# EAGLE design source_eagle (EAGLE 9.6.2)
COMPANY: ADAFRUIT INDUSTRIES; DRAWN: KTOWN; REV: B
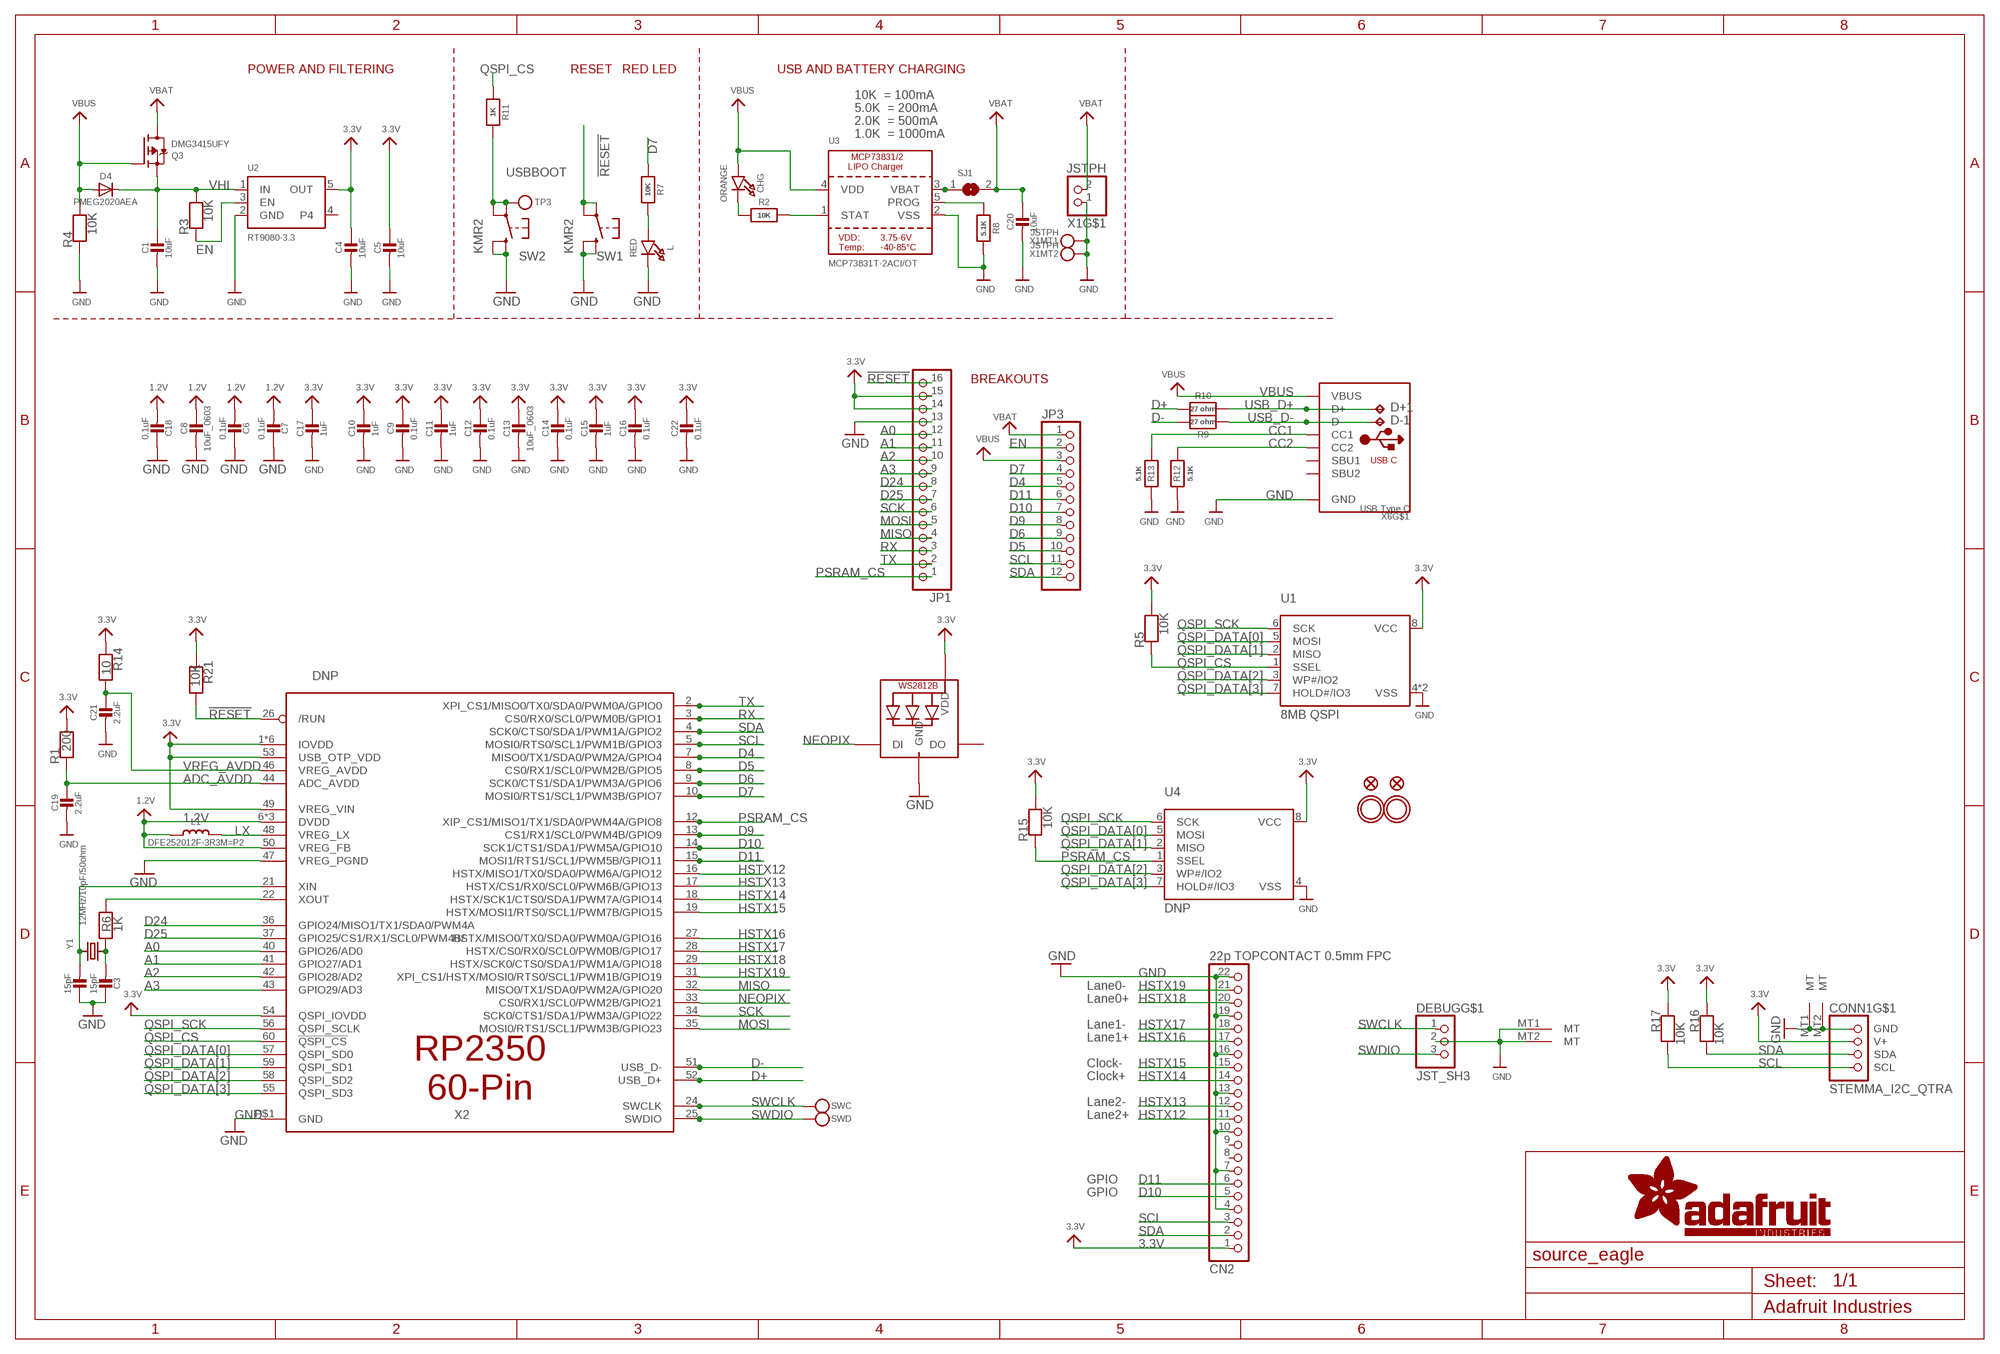
[diagram p0: schematic, sheet 1]

## Parts
C1  10uF  CAP_CERAMIC0805-NOOUTLINE  [0805-NO]
C2  15pF  CAP_CERAMIC_0402NO  [_0402NO]
C3  15pF  CAP_CERAMIC_0402NO  [_0402NO]
C4  10uF  CAP_CERAMIC0805-NOOUTLINE  [0805-NO]
C5  10uF  CAP_CERAMIC0603_NO  [0603-NO]
C6  0.1uF  CAP_CERAMIC_0402NO  [_0402NO]
C7  0.1uF  CAP_CERAMIC_0402NO  [_0402NO]
C8  10uF_0603  CAP_CERAMIC_0603MP  [_0603MP]
C9  0.1uF  CAP_CERAMIC_0402NO  [_0402NO]
C10  1uF  CAP_CERAMIC_0402NO  [_0402NO]
C11  1uF  CAP_CERAMIC_0402NO  [_0402NO]
C12  0.1uF  CAP_CERAMIC_0402NO  [_0402NO]
C13  10uF_0603  CAP_CERAMIC_0603MP  [_0603MP]
C14  0.1uF  CAP_CERAMIC_0402NO  [_0402NO]
C15  1uF  CAP_CERAMIC_0402NO  [_0402NO]
C16  0.1uF  CAP_CERAMIC_0402NO  [_0402NO]
C17  1uF  CAP_CERAMIC_0402NO  [_0402NO]
C18  0.1uF  CAP_CERAMIC_0402NO  [_0402NO]
C19  2.2uF  CAP_CERAMIC_0402NO  [_0402NO]
C20  10uF  CAP_CERAMIC0805-NOOUTLINE  [0805-NO]
C21  2.2uF  CAP_CERAMIC_0402NO  [_0402NO]
C22  0.1uF  CAP_CERAMIC_0402NO  [_0402NO]
CHG  ORANGE  LED0603_NOOUTLINE  [CHIPLED_0603_NOOUTLINE]
CN2  22p TOPCONTACT 0.5mm FPC  HEADER-1X22_22PIN_0.5MM_BOT  [FPC_22PIN]
CONN1  STEMMA_I2C_QTRA  [JST_SH4_RA]
D4  PMEG2020AEA  DIODESOD-323F  [SOD-323F]
D+1  TPB1,27  [B1,27]
D-1  TPB1,27  [B1,27]
DEBUG  JST_SH3  CON_JST_SH_3PINVERT  [JST_SH3_RA]
JP1  HEADER-1X16ROUND  [1X16_ROUND]
JP3  HEADER-1X12  [1X12_ROUND]
L  RED  LED0603_NOOUTLINE  [CHIPLED_0603_NOOUTLINE]
L1  DFE252012F-3R3M=P2  INDUCTOR  [INDUCTOR_1007]
LED1  WS2812B_SK6805_1515  [SK6805_1515]
Q3  DMG3415UFY  MOSFET-P_DFN2015  [DFN2015-3]
R1  200  RESISTOR_0402NO  [_0402NO]
R2  10K  RESISTOR_0402NO  [_0402NO]
R3  10K  RESISTOR_0402NO  [_0402NO]
R4  10K  RESISTOR_0402NO  [_0402NO]
R5  10K  RESISTOR_0402NO  [_0402NO]
R6  1K  RESISTOR_0402NO  [_0402NO]
R7  10K  RESISTOR_0402NO  [_0402NO]
R8  5.1K  RESISTOR_0402NO  [_0402NO]
R9  27 ohm  RESISTOR_0402NO  [_0402NO]
R10  27 ohm  RESISTOR_0402NO  [_0402NO]
R11  1K  RESISTOR_0402NO  [_0402NO]
R12  5.1K  RESISTOR_0402NO  [_0402NO]
R13  5.1K  RESISTOR_0402NO  [_0402NO]
R14  10  RESISTOR_0402NO  [_0402NO]
R15  10K  RESISTOR_0402NO  [_0402NO]
R16  10K  RESISTOR_0402NO  [_0402NO]
R17  10K  RESISTOR_0402NO  [_0402NO]
R21  10K  RESISTOR_0402NO  [_0402NO]
SJ1  SOLDERJUMPERCLOSED  [SOLDERJUMPER_CLOSEDWIRE]
SW1  KMR2  SWITCH_TACT_SMT_RKB2  [BTN_RKB2_4.6X2.8]
SW2  KMR2  SWITCH_TACT_SMT_RKB2  [BTN_RKB2_4.6X2.8]
SWC  TESTPOINTROUND1MM  [TESTPOINT_ROUND_1MM]
SWD  TESTPOINTROUND1MM  [TESTPOINT_ROUND_1MM]
TP3  TESTPOINTROUND1.5MMNO  [TESTPOINT_ROUND_1.5MM_NO]
U1  8MB QSPI  SPIFLASH_8PIN_4X4  [USON8_4X4]
U2  RT9080-3.3  VREG_SOT23-5  [SOT23-5]
U3  MCP73831T-2ACI/OT  MCP73831/2  [SOT23-5]
U4  DNP  SPIFLASH_8PIN  [SOIC8_150MIL]
U$31  MOUNTINGHOLE2.5  [MOUNTINGHOLE_2.5_PLATED]
U$32  MOUNTINGHOLE2.5  [MOUNTINGHOLE_2.5_PLATED]
U$34  FIDUCIAL_1MM  [FIDUCIAL_1MM]
U$35  FIDUCIAL_1MM  [FIDUCIAL_1MM]
X1  JSTPH  CON_JST_PH_2PIN_MT_BATT  [JSTPH2_BATT]
X2  DNP  RP2350_QFN60  [QFN60_7MM_REDUCEDEPAD]
X6  USB Type C  USB_C  [USB_C_CUSB31-CFM2AX-01-X]
Y1  12MHz/10pF/50ohm  CRYSTAL2.5X2.0  [CRYSTAL_2.5X2]

## Nets
1.2V: C6.2 C7.2 C8.1 C18.2 L1.P$1 X2.6(DVDD) X2.23(DVDD) X2.39(DVDD) X2.50(VREG_FB)
3.3V: C4.1 C5.1 C9.1 C10.1 C11.1 C12.1 C13.1 C14.1 C15.1 C16.1 C17.1 C22.1 CN2.1 CONN1.2(V+) JP1.14 JP1.15 LED1.2(VDD) R1.2 R5.2 R14.1 R15.2 R16.1 R17.1 R21.1 U1.8(VCC) U2.5(OUT) U4.8(VCC) X2.1(IOVDD) X2.11(IOVDD) X2.20(IOVDD) X2.30(IOVDD) X2.38(IOVDD) X2.45(IOVDD) X2.49(VREG_VIN) X2.53(USB_OTP_VDD) X2.54(QSPI_IOVDD)
!RESET: JP1.16 R21.2 SW1.A'(P1) SW1.A(P) X2.26(/RUN)
A0: JP1.12 X2.40(GPIO26/AD0)
A1: JP1.11 X2.41(GPIO27/AD1)
A2: JP1.10 X2.42(GPIO28/AD2)
A3: JP1.9 X2.43(GPIO29/AD3)
ADC_AVDD: C19.1 R1.1 X2.44(ADC_AVDD)
CC1: R13.2 X6.A5(CC1)
CC2: R12.2 X6.B5(CC2)
D4: JP3.5 X2.7(MISO0/TX1/SDA0/PWM2A/GPIO4)
D5: JP3.10 X2.8(CS0/RX1/SCL0/PWM2B/GPIO5)
D6: JP3.9 X2.9(SCK0/CTS1/SDA1/PWM3A/GPIO6)
D7: JP3.4 R7.1 X2.10(MOSI0/RTS1/SCL1/PWM3B/GPIO7)
D9: JP3.8 X2.13(CS1/RX1/SCL0/PWM4B/GPIO9)
D10: CN2.5 JP3.7 X2.14(SCK1/CTS1/SDA1/PWM5A/GPIO10)
D11: CN2.6 JP3.6 X2.15(MOSI1/RTS1/SCL1/PWM5B/GPIO11)
D24: JP1.8 X2.36(GPIO24/MISO1/TX1/SDA0/PWM4A)
D25: JP1.7 X2.37(GPIO25/CS1/RX1/SCL0/PWM4B/)
D+: R10.2 X2.52(USB_D+)
D-: R9.2 X2.51(USB_D-)
EN: JP3.2 R3.1 U2.3(EN)
GND [power]: C1.2 C2.1 C3.1 C4.2 C5.2 C6.1 C7.1 C8.2 C9.2 C10.2 C11.2 C12.2 C13.2 C14.2 C15.2 C16.2 C17.2 C18.1 C19.2 C20.2 C21.2 C22.2 CN2.4 CN2.7 CN2.10 CN2.13 CN2.16 CN2.19 CN2.22 CONN1.1(GND) CONN1.MT1(MT) CONN1.MT2(MT) DEBUG.2 DEBUG.MT1(MT) DEBUG.MT2(MT) JP1.13 L.C LED1.4(GND) R4.1 R8.2 R12.1 R13.1 SW1.B'(S1) SW1.B(S) SW2.B'(S1) SW2.B(S) U1.4(VSS) U1.PAD(VSS) U2.2(GND) U3.2(VSS) U4.4(VSS) X1.1 X1.NC1 X1.NC2 X2.47(VREG_PGND) X2.P$1(GND) X6.A1B12(GND) X6.B1A12(GND)
HSTX12: CN2.11 X2.16(HSTX/MISO1/TX0/SDA0/PWM6A/GPIO12)
HSTX13: CN2.12 X2.17(HSTX/CS1/RX0/SCL0/PWM6B/GPIO13)
HSTX14: CN2.14 X2.18(HSTX/SCK1/CTS0/SDA1/PWM7A/GPIO14)
HSTX15: CN2.15 X2.19(HSTX/MOSI1/RTS0/SCL1/PWM7B/GPIO15)
HSTX16: CN2.17 X2.27(HSTX/MISO0/TX0/SDA0/PWM0A/GPIO16)
HSTX17: CN2.18 X2.28(HSTX/CS0/RX0/SCL0/PWM0B/GPIO17)
HSTX18: CN2.20 X2.29(HSTX/SCK0/CTS0/SDA1/PWM1A/GPIO18)
HSTX19: CN2.21 X2.31(XPI_CS1/HSTX/MOSI0/RTS0/SCL1/PWM1B/GPIO19)
LX: L1.P$2 X2.48(VREG_LX)
MISO: JP1.4 X2.32(MISO0/TX1/SDA0/PWM2A/GPIO20)
MOSI: JP1.5 X2.35(MOSI0/RTS1/SCL1/PWM3B/GPIO23)
N$1: CHG.C R2.1
N$2: L.A R7.2
N$3: R2.2 U3.1(STAT)
N$4: R8.1 U3.5(PROG)
N$5: C2.2 X2.21(XIN) Y1.3
N$6: C3.2 R6.1 Y1.1
N$7: R6.2 X2.22(XOUT)
N$8 [power]: SJ1.1 U3.3(VBAT)
NEOPIX: LED1.1(DI) X2.33(CS0/RX1/SCL0/PWM2B/GPIO21)
PSRAM_CS: JP1.1 R15.1 U4.1(SSEL) X2.12(XIP_CS1/MISO1/TX1/SDA0/PWM4A/GPIO8)
QSPI_CS: R5.1 R11.1 U1.1(SSEL) X2.60(!QSPI_CS)
QSPI_DATA[0]: U1.5(MOSI) U4.5(MOSI) X2.57(QSPI_SD0)
QSPI_DATA[1]: U1.2(MISO) U4.2(MISO) X2.59(QSPI_SD1)
QSPI_DATA[2]: U1.3(WP#/IO2) U4.3(WP#/IO2) X2.58(QSPI_SD2)
QSPI_DATA[3]: U1.7(HOLD#/IO3) U4.7(HOLD#/IO3) X2.55(QSPI_SD3)
QSPI_SCK: U1.6(SCK) U4.6(SCK) X2.56(QSPI_SCLK)
RX: JP1.3 X2.3(CS0/RX0/SCL0/PWM0B/GPIO1)
SCK: JP1.6 X2.34(SCK0/CTS1/SDA1/PWM3A/GPIO22)
SCL: CN2.3 CONN1.4(SCL) JP3.11 R17.2 X2.5(MOSI0/RTS0/SCL1/PWM1B/GPIO3)
SDA: CN2.2 CONN1.3(SDA) JP3.12 R16.2 X2.4(SCK0/CTS0/SDA1/PWM1A/GPIO2)
SWCLK: DEBUG.1 SWC.P$1 X2.24(SWCLK)
SWDIO: DEBUG.3 SWD.P$1 X2.25(SWDIO)
TX: JP1.2 X2.2(XPI_CS1/MISO0/TX0/SDA0/PWM0A/GPIO0)
USB_D+: D+1.TP R10.1 X6.A6(D+) X6.B6(D+)
USB_D-: D-1.TP R9.1 X6.A7(D-) X6.B7(D-)
USBBOOT: R11.2 SW2.A'(P1) SW2.A(P) TP3.P$1
VBAT [power]: C20.1 JP3.1 Q3.3(D) SJ1.2 X1.2
VBUS [power]: CHG.A D4.A JP3.3 Q3.1(G) R4.2 U3.4(VDD) X6.A4B9(VBUS) X6.B4A9(VBUS)
VHI: C1.1 D4.C Q3.2(S) R3.2 U2.1(IN)
VREG_AVDD: C21.1 R14.2 X2.46(VREG_AVDD)
Unconnected: CN2.8 CN2.9 LED1.3(DO) U2.4 X6.A8(SBU1) X6.B8(SBU2) X6.M1(MT) X6.M2(MT) X6.M3(MT) X6.M4(MT)

## Notes on the sheet
- POWER AND FILTERING | RESET | RED LED | USB AND BATTERY CHARGING
- 10K  = 100mA
- 5.0K  = 200mA
- 2.0K  = 500mA
- 1.0K  = 1000mA
- BREAKOUTS
- Lane0-
- Lane0+
- Lane1-
- Lane1+
- Clock-
- Clock+
- Lane2-
- Lane2+
- GPIO
- GPIO

## Library data of the parts
C1-C3 C5-C22 = microbuilder:CAP_CERAMIC: Ceramic Capacitors For new designs, use the packages preceded by an '_' character since they are more reliable: The following footprints should be used on most boards: _0402 - Standard footprint for regular board layouts _0603 - Standard footprint for regular board layouts _0805 - Standard footprint for regular board layouts _1206 - Standard footprint for regular board layouts For extremely tight-pitch boards where space is at a premium, the following 'micro-pitch' footprints can be used (smaller pads, no silkscreen outline, etc.): _0402MP - Micro-pitch footprint for very dense/compact boards _0603MP - Micro-pitch footprint for very dense/compact boards _0805MP - Micro-pitch footprint for very dense/compact boards _1206MP - Micro-pitch footprint for very dense/compact boards
C4 = microbuilder:CAP_CERAMIC: Ceramic Capacitors For new designs, use the packages preceded by an '_' character since they are more reliable: The following footprints should be used on most boards: _0402 - Standard footprint for regular board layouts _0603 - Standard footprint for regular board layouts _0805 - Standard footprint for regular board layouts _1206 - Standard footprint for regular board layouts For extremely tight-pitch boards where space is at a premium, the following 'micro-pitch' footprints can be used (smaller pads, no silkscreen outline, etc.): _0402MP - Micro-pitch footprint for very dense/compact boards _0603MP - Micro-pitch footprint for very dense/compact boards _0805MP - Micro-pitch footprint for very dense/compact boards _1206MP - Micro-pitch footprint for very dense/compact boards; REV: B
CHG L = microbuilder:LED: LED 0603 - 0603 Surface Mount Package 2mA: Green LED - Low Power (3.9mcd, 2ma, 1.7Vf) - Digikey: 475-2709-2-ND Orange LED - Low Power (9.8mcd, 2ma, 1.8Vf) - Digikey: 475-1194-2-ND Red LED - Low Power (5mcd, 2ma, 1.8Vf) - Digikey: 475-1195-2-ND Yellow LED - Low Power (7mcd, 2ma, 1.8Vf) - Digikey: 475-1196-2-ND 5mA: Blue LED - Low Power (17mcd, 5ma, 2.9Vf) - Digikey: LNJ937W8CRACT-ND 0805 - 0805 Surface Mount Package 2mA: Red LED (8.8mcd, 2mA, 1.8Vf, Clear) - Low Power [Digikey: 475-2510-1-ND] Green LED (5mcd, 2mA, 1.8Vf, Clear) - Low Power [Digikey: 475-2730-1-ND] Yellow LED (11.3mcd, 2mA, 1.8Vf, Clear) - Low Power [Digikey: 475-2555-1-ND] 20mA: Red LED (104mcd, 20mA, Diffused) - LS R976 [Digikey: 475-1278-6-ND] Red LED (12mcd, 20mA, 2.0Vf, Clear) - APT2012EC [Digikey: 754-1128-1-ND] Green LED (15mcd, 20mA, 2.2Vf, Clear) - APT2012GC [Digikey: 754-1131-1-ND] Orange LED (160mcd, 20mA, 2.1Vf, Clear) - APT2012SECK [Digikey: 754-1130-1-ND] 1206 - 1206 Surface Mount Package Green LED (26mcd, 20mA, Diffused) - LG N971 [Digikey: 475-1407-6-ND] Red LED (15mcd, 20mA, Diffused) - LH N974 [Digikey: 475-1416-6-ND] Cree - Cree High-Power Surface Mount LEDs XPEBWT-L1-0000-00D50 - White 111lm 350mA 2.9Vf 6200K 110° XTEAWT-00-0000-00000LEE3 - White 114lm 350mA 2.85Vf 5000K 115° Everlight - Everlight 45-21 Series Surface Mount LEDs 45-21/QK2C-B2832AC2CB2/2T - Warm White 2000mcd 20mA 3.25Vf 3050K 120° 45-21/LK2C-B38452C4CB2/2T - Nuetral White 2000mcd 20mA 3.25Vf 4150K 120° 45-21/LK2C-B50634C6CB2/2T - Cold White 2200mcd 20mA 3.25Vf 5650K 120° PLCC2 Reverse Mount LS T77K-J1L2-1-0-2-R18-Z - Red 11.25mcd 2mA 1.8Vf 630nm 120° LO T77K-L1M2-24-Z - Orange 19.6mcd 2mA 1.8Vf 606nm 120° LY T77K-K2M1-26-Z - Yellow 15.7mcd 2mA 1.8Vf 587nm 120°; ROT: 270
CN2 = adafruit_electromech:HEADER-1X22
CONN1 = adafruit_electromech:STEMMA_I2C; LCSC: C145961
D4 = adafruit:DIODE: Diode SMADIODE - SMA Surface Mount Package 20V 1A Schottky Diode Digikey: 641-1014-6-ND DO-1N4148 - Through Hole Small Current Diode SOD-123 20V 1 A (.5mV Vf) Schottky Diode - Digikey: MBRX120TPMSCT-ND SOD-323 10V 570mA (.38mV Vf, 3ns) Schottky Diode - Digikey: ZLLS410CT-ND SOD-523 30V 30mA Schottky Diode (RB751S-40TE61) - Digikey: RB751S-40TE61CT-ND SOT23-R/W - SOT23 Package (R = Solder Paste/Reflow Ovens, W = Hand-Soldering) BAT54Film 40V 300mA - Digikey: 497-7162-1-ND
D+1 D-1 = testpad:TP: Test pad
DEBUG = adafruit_electromech:CON_JST_SH_3PIN
JP1 = microbuilder:HEADER-1X16: PIN HEADER
JP3 = microbuilder:HEADER-1X12
L1 = microbuilder:INDUCTOR: Inductors 0603: 10nH Ceramic Inductor - microwire antenna/RF (Digikey: 712-1434-2-ND) 0805: 560nH Ceramic Inductor - RF (Digikey: 553-1047-1-ND) 270nH Ceramic Inductor - Q = 40@250MHz, +-5%, 1 Ohm DC Resistance (Digikey: 535-10506-2-ND) 1007 (2518 Metric) SMT: 10µH 10% 250mOhm 820mA 1007 Inductor (Digikey: 587-2189-1-ND) 22µH 10% 500mOhm 580mA 1007 Inductor (Digikey: 587-2190-1-ND) 47µH 10% 950mOhm 420mA 1007 Inductor (Digikey: 587-2191-1-ND) 47µH 5% 100mOhm 1A 1008 Inductor (Digikey: 732-1816-1-ND) 5.0x5.0mm (Taiyo Yuden NR5040 Series) 6.8µH 20% 2.3A 64mOhm Inductor (Digikey: 587-2374-2-ND) 5.0x5.0mm (TDK VLC5045 Series) 4.7µH 20% 3.3A 34mOhm Inductor (Digikey: 445-6526-1-ND) 6.8µH 20% 2.7A 46mOhm Inductor (Digikey: 445-6527-1-ND) 6.0x6.0mm (TDK VLC6045 Series) 4.7µH 20% 3.8A 27mOhm Inductor (Digikey: 445-6538-2-ND) 6.8µH 20% 3A 41mOhm Inductor (Digikey: 445-6540-1-ND) 6.2µH 30% 2.2A 45mOhm Inductor (Digikey: SRR5028-6R2YCT-ND) - Not TDK VLC6045 but footprint should match 6.0x6.0mm (TDK SLF6045 Series) 6.8uH 30% 2A 33mOhm Inductor (Digikey: 445-4572-1-ND, Mouser: 810-SLF645T6R8N2R0PF) 6.0x6.0mm (Sumida CDRH5D28 Series) 6.2uH 30% 1.8A 45mOhm Inductor (Digikey: 308-1542-1-ND) Taiyo Yuden NR3015T2R2M - 2.2uH 20% 1.5A (Digikey: 587-1648-2-ND, Mouser: 963-NR3015T2R2M) - Used with TI TPS62172 CoilCraft RFID Transponder Coil - MA5532-AE (For use with AS3935 Lightning Sensor) Taiyo Yuden NRH2412T2R2MNGH - 2.2uH 20% 1AA (Digikey: 587-3443-1-ND) - Used with TI LM3671 Vishay IHLP 1.0uH Molded Inductor - 24mOhm DCR, 5A, +/-20%, -55°C-125°C (Digikey: 541-1319-1-ND)
LED1 = microbuilder:WS2812B; LCSC: C2890035
Q3 = microbuilder:MOSFET-P: P-Channel Mosfet LEGEND VDS: Voltage Drain-Source ID: Drain Current RDS(ON): Drain-Source On-State Resistance VGS(TH): Gate-Source Threshold Voltage CISS: Drain-Source Input Capacitance SOT-23 Name VDS ID RDS(ON) VGS(TH) CISS Order Number IRLML5103 30V 760mA 600 mOhm -- 75pF @ 25V Digikey: IRLML5103PBFCT-ND IRLML6401 12V 4.3A 50 mOhm 950mV @ 250µA 830pF @ 10V Digikey: IRLML6401PBFTR-ND NTR0202PL 20V 400mA 800 mOhm 2.3V @ 250uA 70pF @ 5V Digikey: NTR0202PLT1GOSTR-ND NTR4101PT1G 20V 1.8A 85 mOhm 1.2V @ 250uA 675pF @ 10V Digikey: NTR4101PT1GOSCT-ND DMP2004K 20V 600mA 900 mOhm 1V @ 250uA 175pF @ 16V Digikey: DMP2004KDICT-ND PMV65XP 20V 3.9A 76 mOhm 950mV @ 1mA 725pF @ 20V Digikey: 568-2358-2-ND TO-252 Name VDS ID RDS(ON) VGS(TH) CISS Order Number AOD417 30V 25A 34 mOhm 3V @ 250µA 920pF @ 15V Digikey: 785-1106-2-ND PowerPak Name VDS ID RDS(ON) VGS(TH) CISS Order Number AON7401 30V 12A 14 mOhm 3V @ 250µA 2600pF @ 15V Digikey: 785-1302-1-ND
R1-R17 R21 = microbuilder:RESISTOR: Resistors For new designs, use the packages preceded by an '_' character since they are more reliable: The following footprints should be used on most boards: _0402 - Standard footprint for regular board layouts _0603 - Standard footprint for regular board layouts _0805 - Standard footprint for regular board layouts _1206 - Standard footprint for regular board layouts For extremely tight-pitch boards where space is at a premium, the following 'micro-pitch' footprints can be used (smaller pads, no silkscreen outline, etc.): _0402MP - Micro-pitch footprint for very dense/compact boards _0603MP - Micro-pitch footprint for very dense/compact boards _0805MP - Micro-pitch footprint for very dense/compact boards _1206MP - Micro-pitch footprint for very dense/compact boards
SJ1 = microbuilder:SOLDERJUMPER: SMD Solder JUMPER Solder the two pads together to create a connection, or remove the solder to break it. REFLOW - Use this footprint for solder paste and reflow ovens. WAVE - Use this footprint for hand-soldering (larger pads). CLOSED - Has a trace between the two pads to ensure it is closed by default. The trace needs to be cut to disable the jumper, and can be closed again by creating a solder bridge between the two pads.
SW1 SW2 = adafruit_electromech:SWITCH_TACT_SMT: SMT Tact Switches RKB2 https://www.digikey.com/short/m027prz5
SWC SWD TP3 = microbuilder:TESTPOINT: Test Point Various test points for characterisation and PCB testing TESTPOINT_SMT - Compact Surface Mount Test Point [Digikey: 5016KTR-ND]
U1 U4 = microbuilder:SPIFLASH_8PIN: SOIC8 SPI Flash Be careful with the size since SOIC8 flash comes in several 'widths' SOIC8 150 mil M25P16 - 16Mbit (2Mbit x 8) Serial Flash (75MHz SPI Bus), Supply: 2.7-3.6V Digikey: SOIC8 - M25P16-VMN6P-ND SOIC8 208 mil W25Q16BVSSIG - 16Mbit (2Mbit x 8) Serial Flash (104MHz SPI Bus), Supply: 2.7-3.6V Digikey: SOIC8 - W25Q16BVSSIG-ND
U2 = adafruit_power:VREG_SOT23-5: SOT23-5 Fixed Voltage Regulators Part Current Out V Out V In V Dropout θJA (°C/W) TJ (°C) Digikey Part No. ADP121 150mA 3.3V 3.4-5.5V 0.09V @ 150mA -- -- ADP121-AUJZ33R7CT-ND ADP121 150mA 3.0V 3.1-5.5V 0.09V @ 150mA -- -- ADP121-AUJZ30R7CT-ND ADP122 300mA 3.3V 3.4-5.5V 0.085V @ 300mA -- -- ADP122AUJZ-3.3-R7CT-ND ADP1712 300mA 3.3V 3.5-5.5V 0.17V @ 300mA -- -- ADP1712AUJZ-3.3-R7TR-ND AP7311 (Low Cost) 150mA 3.3V 3.5-6V 0.15V @ 150mA -- -- AP7311-33WG-7DICT-ND LD39015M18R 150mA 1.8V 1.9V-5.5V 0.08V @ 100mA -- -- 497-6977-1-ND LP2985A-33DBVR 150mA 3.3V 3.3-16V 0.28V @ 150mA 206 150 296-18479-1-ND MCP1824T-3302E/OT 300mA 3.3V 3.5V-6V 0.2V @ 300mA -- -- MCP1824T-3302E/OTCT-ND MIC5205-2.5YM5 TR 150mA 2.5V 2.7-16V 0.165V @ 150mA -- -- 576-1257-2-ND MIC5205-3.0YM5 TR 150mA 3.0V 3.2V-16V 0.165V @ 150mA -- -- 576-1258-2-ND MIC5205-3.3YM5 TR 150mA 3.3V 3.5V-16V 0.165V @ 150mA -- -- 576-1259-2-ND TPS780330220 150mA 3.3V+2.2V 3.6-5.5V 250mV Max -- -- 296-23332-1-ND TDA3663/N1,135 100mA 3.3V 3.5-45V 0.18V @ 50mA -- -- 568-5343-1-ND Max operating temp can be calculated using θJA, TJ (max junction temperature), and power in watts. Set the "Maximum Ambient Temperature" until it reaches TJ ("Max Junction Temperature"), which is the absolute limit for safe use of the regulator: Heat Sink Temperature Calculator <http://www.daycounter.com/Calculators/Heat-Sink-Temperature-Calculator.phtml> For example, With 12V source into a 3.3V LP2985 and a 30mA load, we are dissipating (12V-3.3V) * 0.03A = 0.261W. With a θJA of 206 °C/W, a TJ of 150°C, and 261mW we can safely use the chip without a heat sink up to 75°C (=147.1°C Junction Temperature).; JLC_ROTATION: 0
U3 = microbuilder:MCP73831/2: MCP73831/2 LIPO Charger VDD: 3.75 - 6V Temp -40 - 85°C Programmable Charge Rate: 15-500mA NOTE: STAT is a tri-state logic output on the MCP73831 and an open-drain output on the MCP73832. SOT23-5 with 4.2V output and tri-state logic on STAT = MCP73831T-2ACI/OT; JLC_ROTATION: 0; LCSC: C424093
U$31 U$32 = adafruit_electromech:MOUNTINGHOLE: Mounting Hole For #2 screws (0.086"/2.18mm width, 0.094"/2.4mm hole) use 2.5mm; BOM: EXCLUDE
U$34 U$35 = microbuilder:FIDUCIAL: Fiducial Alignment Points Various fiducial points for machine vision alignment.; BOM: EXCLUDE
X1 = adafruit_electromech:CON_JST_PH_2PIN_MT; LCSC: C47647
X2 = adafruit_micro:RP2350
X6 = adafruit_electromech:USB_C: USB Type-C USB 2.0 Connector; LCSC: C165948
Y1 = microbuilder:CRYSTAL: Crystals HC49UP - Surface Mount Crystal 4.0MHz 18pF +/-30ppm Surface Mount Crystal [Digikey: 535-9857-1-ND] 12.0 MHz Surface Mount Crystal [Digikey: 535-9869-6-ND] 25.0 MHz Surface Mount Crystal [Digikey: 535-9078-1-ND] 2.5 x 2.0mm - MEMs SMT Crystal 16.0 MHz 10pF 20ppm 2.5 x 2.0mm Crystal [Digikey -40-85°C: 535-10923-1-ND] 3.2 x 2.5mm - MEMs SMT Crystal 12.0 MHz 8pF 15ppm 3.2 x 2.5mm Crystal [Digikey: -10-70°C: 644-1047-1-ND -40-125°C: 644-1128-1-ND] 40~85°C cheaper: 644-1173-6-ND 16.0 MHz 8pF 15ppm 3.2 x 2.5mm Crystal [Digikey: -10-70°C: 644-1049-1-ND -40-125°C: 644-1129-2-ND]-40~85°C cheaper: 644-1175-6-ND 16.0 MHz 10pF 10ppm 3.2 x 2.5mm Crystal [Digikey: 644-1100-1-ND] 27.12 MHz 18pF 30ppm 3.2 x 2.5mm Crystal [Digikey: 887-1424-1-ND] 27.12MHz 10pF 10ppm 3.2 x 2.5mm Crystal [Digikey: 887-1329-1-ND] 4.9 x 1.8mm - MEMs SMT Crystal 32.768 KHz 12.5pF 20ppm 4.9 x 1.8mm Crystal [Digikey: SE2415CT-ND] 8.0 x 3.8mm - Surface Mount Crystal 32.768kHz 12.5pF 20ppm -40°C-85°C [Digikey: 535-9166-2-ND] Cylinder 32.768KHz Cylinder Crystal (2x6mm body) [Ex. Digikey: 300-8341-2-ND]

## Net classes
1 power: width 0.305 mm, drill 0.381 mm
2 gnd: width 0.254 mm

## Board
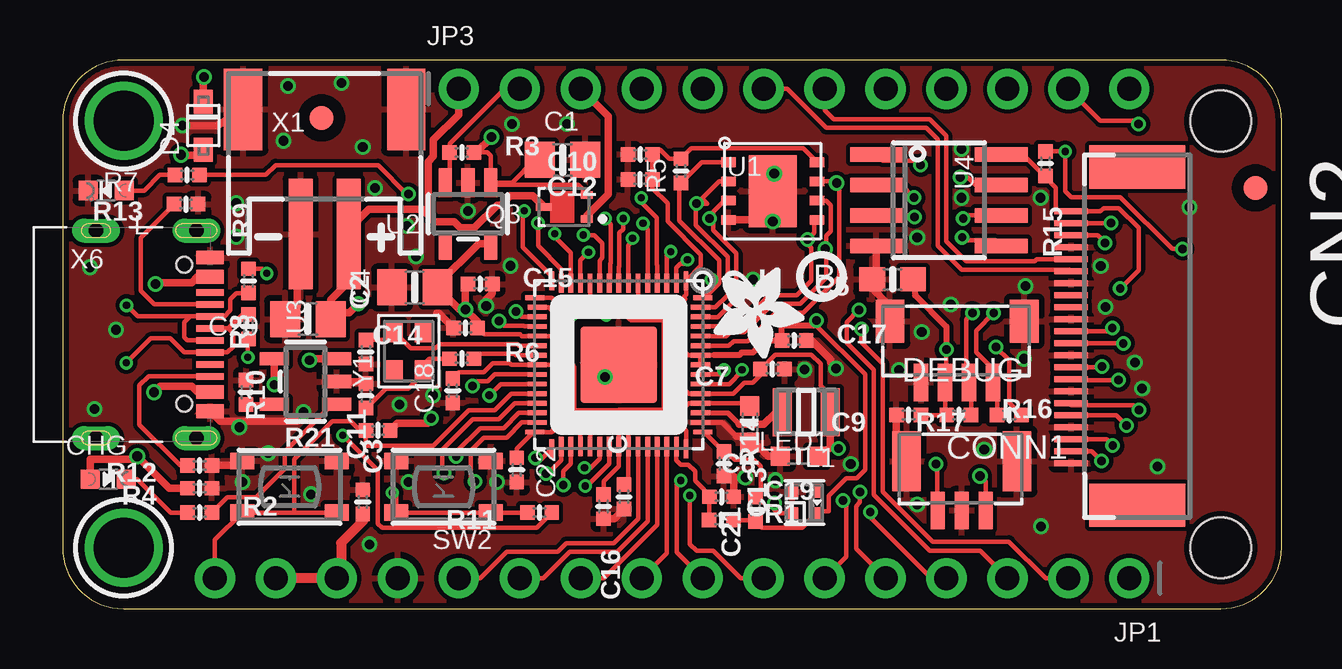
[diagram p1: board, top side]
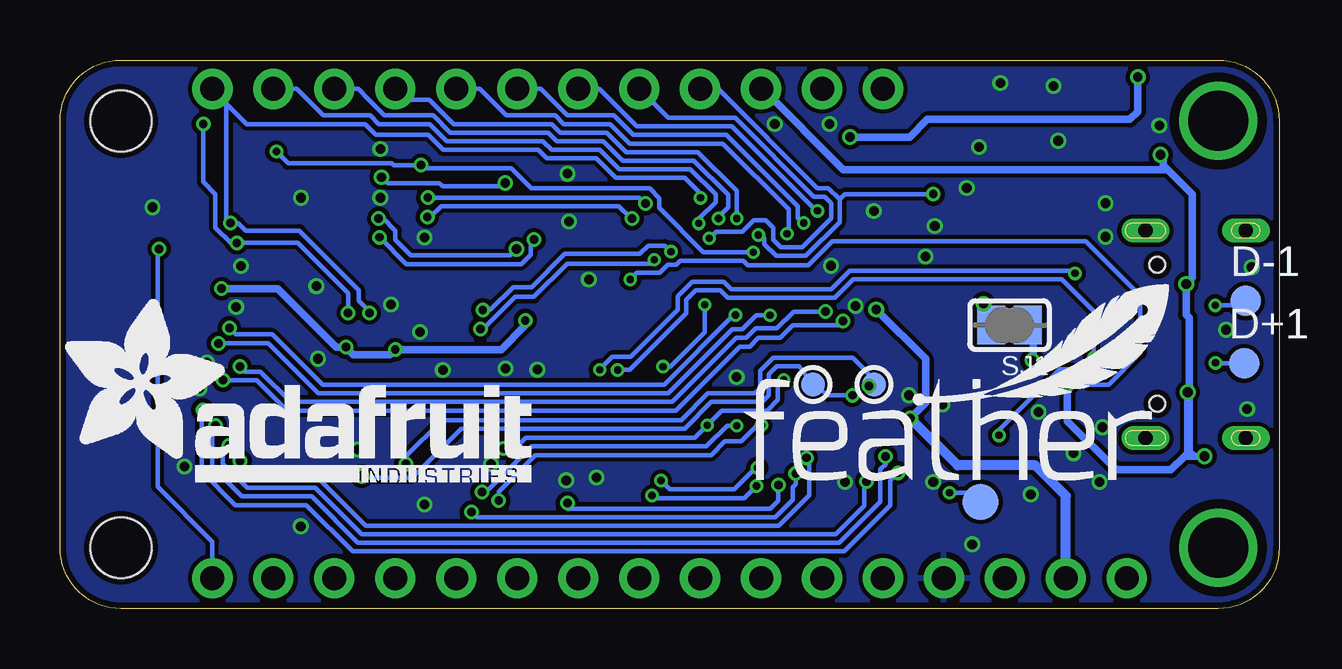
[diagram p2: board, bottom side, seen from below]

Size 50.8 x 22.86 mm. Coordinates in mm from the lower left corner, seen from the top.
Outline: 2.54,0 48.26,0 arc90 50.8,2.54 50.8,20.32 arc90 48.26,22.86 2.54,22.86 arc90 0,20.32 0,2.54 arc90 2.54,0
Copper layers (1*16): Top 0.035mm / dielectric 1.5mm / Bottom 0.035mm
Design rules "adafruit 7-7 *": minimum track width 7mil, minimum drill 8mil, track to track 7mil, track to pad 7mil, pad to pad 7mil, via to via 7mil, smd to smd 7mil, copper to edge 10mil, drill to drill 8mil, minimum pad ring 7mil, minimum via ring 5mil, stop-mask expansion 2mil, vias tented up to drill 20mil, thermal gap 10mil
Holes 2.54 mm at 48.26,20.32 48.26,2.54

### Footprints (pad centres in the part's own frame; a part is rotated, then mirrored left to right if it is on the bottom)
0805-NO = smd 1.24 x 1.5: 1 -0.95,0; 2 0.95,0
_0402NO = smd 0.6 x 0.6: 1 -0.508,0; 2 0.508,0
0603-NO = smd 1.075 x 1: 1 -0.85,0; 2 0.85,0
_0603MP = smd 0.8 x 0.8: 1 -0.762,0; 2 0.762,0
CHIPLED_0603_NOOUTLINE = smd 0.8 x 0.8: A 0,-0.75; C 0,0.75
FPC_22PIN = smd 0.25 x 1.4: 1 -5.25,-1.154; 2 -4.75,-1.154; 3 -4.25,-1.154; 4 -3.75,-1.154; 5 -3.25,-1.154; 6 -2.75,-1.154; 7 -2.25,-1.154; 8 -1.75,-1.154; 9 -1.25,-1.154; 10 -0.75,-1.154; 11 -0.25,-1.154; 12 0.25,-1.154; 13 0.75,-1.154; 14 1.25,-1.154; 15 1.75,-1.154; 16 2.25,-1.154; 17 2.75,-1.154; 18 3.25,-1.154; 19 3.75,-1.154; 20 4.25,-1.154; 21 4.75,-1.154; 22 5.25,-1.154 | smd 1.8 x 4: SUPPORT1 7,1.598; SUPPORT2 -7.1,1.598
JST_SH4_RA = smd 0.6 x 1.55: 1 1.5,0.924; 2 0.5,0.924; 3 -0.5,0.924; 4 -1.5,0.924 | smd 1.2 x 1.8: MT1 -2.8,-1.624; MT2 2.8,-1.624
SOD-323F = smd 1 x 0.8: A -1,0; C 1,0
B1,27 = smd 1.27 x 1.27: TP 0,0
JST_SH3_RA = smd 0.6 x 1.55: 1 1,0.924; 2 0,0.924; 3 -1,0.924 | smd 1.2 x 2.5: MT1 -2.3,-1.124; MT2 2.3,-1.124
1X16_ROUND = drill 1 pad 1.676: 1 -19.05,0; 2 -16.51,0; 3 -13.97,0; 4 -11.43,0; 5 -8.89,0; 6 -6.35,0; 7 -3.81,0; 8 -1.27,0; 9 1.27,0; 10 3.81,0; 11 6.35,0; 12 8.89,0; 13 11.43,0; 14 13.97,0; 15 16.51,0; 16 19.05,0
1X12_ROUND = drill 1 pad 1.676: 1 -13.97,0; 2 -11.43,0; 3 -8.89,0; 4 -6.35,0; 5 -3.81,0; 6 -1.27,0; 7 1.27,0; 8 3.81,0; 9 6.35,0; 10 8.89,0; 11 11.43,0; 12 13.97,0
INDUCTOR_1007 = smd 0.8 x 2: P$1 -1,0; P$2 1,0
SK6805_1515 = smd 0.5 x 0.5: 1 -0.5,-0.45; 2 0.5,-0.45; 3 0.5,0.45; 4 -0.5,0.45
DFN2015-3 = smd 0.5 x 0.31: 1 -0.95,0.5; 2 -0.95,-0.5 | smd 0.65 x 0.31: 3 0.825,0
SOLDERJUMPER_CLOSEDWIRE = smd 1.168 x 1.6: 1 -0.762,0; 2 0.762,0 | smd 0.635 x 0.203: WIRE 0,0
BTN_RKB2_4.6X2.8 = smd 1 x 0.7: A 1.973,1.075; A' -1.973,1.075; B 1.973,-1.075; B' -1.973,-1.075
TESTPOINT_ROUND_1MM = smd 1 x 1: P$1 0,0
TESTPOINT_ROUND_1.5MM_NO = smd 1.5 x 1.5: P$1 0,0
USON8_4X4 = smd 0.6 x 0.4: 1 -1.85,1.2; 2 -1.85,0.4; 3 -1.85,-0.4; 4 -1.85,-1.2; 5 1.85,-1.2; 6 1.85,-0.4; 7 1.85,0.4; 8 1.85,1.2 | smd 2 x 3: PAD 0,0
SOT23-5 = smd 0.55 x 1.2: 1 -0.95,-1.3; 2 0,-1.3; 3 0.95,-1.3; 4 0.95,1.3; 5 -0.95,1.3
SOIC8_150MIL = smd 0.6 x 2.2: 1 -1.905,-2.6; 2 -0.635,-2.6; 3 0.635,-2.6; 4 1.905,-2.6; 5 1.905,2.6; 6 0.635,2.6; 7 -0.635,2.6; 8 -1.905,2.6
MOUNTINGHOLE_2.5_PLATED = drill 2.5 pad 3.2: P$1 0,0
FIDUCIAL_1MM = smd 1 x 1: 1 0,0
JSTPH2_BATT = smd 1 x 4.6: 1 -1,-2.303; 2 1,-2.303 | smd 1.6 x 3.4: NC1 -3.4,2.897; NC2 3.4,2.897
QFN60_7MM_REDUCEDEPAD = smd 0.8 x 0.2: 1 -3.5,2.8; 2 -3.4,2.4; 3 -3.4,2; 4 -3.4,1.6; 5 -3.4,1.2; 6 -3.4,0.8; 7 -3.4,0.4; 8 -3.4,0; 9 -3.4,-0.4; 10 -3.4,-0.8; 11 -3.4,-1.2; 12 -3.4,-1.6; 13 -3.4,-2; 14 -3.4,-2.4; 15 -3.5,-2.8; 31 3.5,-2.8; 32 3.4,-2.4; 33 3.4,-2; 34 3.4,-1.6; 35 3.4,-1.2; 36 3.4,-0.8; 37 3.4,-0.4; 38 3.4,0; 39 3.4,0.4; 40 3.4,0.8; 41 3.4,1.2; 42 3.4,1.6; 43 3.4,2; 44 3.4,2.4; 45 3.5,2.8 | smd 0.2 x 0.8: 16 -2.8,-3.5; 17 -2.4,-3.4; 18 -2,-3.4; 19 -1.6,-3.4; 20 -1.2,-3.4; 21 -0.8,-3.4; 22 -0.4,-3.4; 23 0,-3.4; 24 0.4,-3.4; 25 0.8,-3.4; 26 1.2,-3.4; 27 1.6,-3.4; 28 2,-3.4; 29 2.4,-3.4; 30 2.8,-3.5; 46 2.8,3.5; 47 2.4,3.4; 48 2,3.4; 49 1.6,3.4; 50 1.2,3.4; 51 0.8,3.4; 52 0.4,3.4; 53 0,3.4; 54 -0.4,3.4; 55 -0.8,3.4; 56 -1.2,3.4; 57 -1.6,3.4; 58 -2,3.4; 59 -2.4,3.4; 60 -2.8,3.5 | smd 3.2 x 3.2: P$1 0,0
USB_C_CUSB31-CFM2AX-01-X = smd 0.575 x 1.15: A1B12 -3.2,2.275; A4B9 -2.4,2.275; B1A12 3.2,2.275; B4A9 2.4,2.275 | smd 0.275 x 1.15: A5 -1.25,2.275; A6 -0.25,2.275; A7 0.25,2.275; A8 1.25,2.275; B5 1.75,2.275; B6 0.75,2.275; B7 -0.75,2.275; B8 -1.75,2.275 | drill 0.6 pad 1 long: M1 -4.32,1.7; M2 4.32,1.7; M3 -4.32,-2.48; M4 4.32,-2.48 | hole 0.65: 2.89,1.2; -2.89,1.2
CRYSTAL_2.5X2 = smd 0.9 x 0.75: 1 -0.825,-0.625; 2 0.825,-0.625; 3 0.825,0.625; 4 -0.825,0.625

### Placement (x,y rotation side)
C1  20.83,18.7 0 top
C2  12.64,10.69 90 top
C3  12.64,8.86 270 top
C4  14.67,13.38 180 top
C5  34.58,13.73 180 top
C6  23.39,4.66 90 top
C7  29.58,9.98 180 top
C8  30.67,6.35 180 top
C9  35.26,8.06 180 top
C10  24.07,18.93 180 top
C11  12.51,4.45 90 top
C12  24.07,17.88 180 top
C13  28.64,7.68 270 top
C14  16.79,11.7 180 top
C15  17.4,13.53 0 top
C16  22.54,4.25 270 top
C17  30.48,11.18 0 top
C18  16.26,9.08 90 top
C19  27.46,4.66 0 top
C20  10.22,12.06 180 top
C21  27.56,6.03 270 top
C22  18.92,5.78 270 top
CHG  1.91,5.4 270 top
CN2  43.18,11.3 270 top
CONN1  37.27,10.35 180 top
D4  5.87,20.13 90 top
D+1  1.46,10.22 0 bottom
D-1  1.4,12.83 0 bottom
DEBUG  37.47,5.02 180 top
JP1  25.4,1.27 180 top
JP3  30.48,21.65 0 top
L  1.82,17.42 90 top
L1  30.99,8.19 180 top
LED1  30.91,4.42 0 top
PLABEL0  [PLABEL0]  16.07,7.37 0 top
PLABEL1  [PLABEL1]  9.78,7.37 0 top
PLABEL2  [PLABEL2]  3.61,5.64 90 top
PLABEL3  [PLABEL3]  3.61,17.45 90 top
PLABEL4  [PLABEL4]  6.35,2.79 0 top
PLABEL5  [PLABEL5]  13.78,2.73 0 top
PLABEL6  [PLABEL6]  16.51,2.73 0 top
PLABEL7  [PLABEL7]  19.05,2.73 0 top
PLABEL8  [PLABEL8]  21.59,2.79 0 top
PLABEL9  [PLABEL9]  24.13,2.79 0 top
PLABEL10  [PLABEL10]  26.67,2.79 0 top
PLABEL11  [PLABEL11]  29.21,2.79 0 top
PLABEL12  [PLABEL12]  31.75,2.79 0 top
PLABEL13  [PLABEL13]  34.29,2.79 0 top
PLABEL14  [PLABEL14]  36.83,2.79 0 top
PLABEL15  [PLABEL15]  39.37,2.79 0 top
PLABEL16  [PLABEL16]  41.91,2.79 0 top
PLABEL17  [PLABEL17]  42.1,20.13 0 top
PLABEL18  [PLABEL18]  44.96,20.13 0 top
PLABEL19  [PLABEL19]  39.37,20.13 0 top
PLABEL20  [PLABEL20]  36.83,20.13 0 top
PLABEL21  [PLABEL21]  34.29,20.13 0 top
PLABEL22  [PLABEL22]  31.94,20.13 0 top
PLABEL23  [PLABEL23]  29.34,20.13 0 top
PLABEL24  [PLABEL24]  26.67,20.13 0 top
PLABEL25  [PLABEL25]  24.26,20.13 0 top
PLABEL26  [PLABEL26]  21.59,20.13 0 top
PLABEL27  [PLABEL27]  18.99,20.13 0 top
PLABEL28  [PLABEL28]  16.51,20.13 0 top
PLABEL29  [PLABEL29]  10.29,2.79 0 top
PLABEL30  [PLABEL30]  48.01,11.24 90 top
PLABEL31  [PLABEL31]  33.24,10.93 90 top
PLABEL32  [PLABEL32]  33.5,6.01 90 top
PLABEL33  [PLABEL33]  38.62,13.75 0 top
PLABEL34  [PLABEL34]  23.95,14.71 0 top
PLABEL35  [PLABEL35]  32.03,11.25 90 top
PLABEL36  [PLABEL36]  44.51,2.79 0 top
PLABEL37  [PLABEL37]  28.77,14.48 0 bottom
PLABEL38  [PLABEL38]  44.45,2.35 90 bottom
PLABEL39  [PLABEL39]  41.91,2.35 90 bottom
PLABEL40  [PLABEL40]  39.37,2.35 90 bottom
PLABEL41  [PLABEL41]  36.83,2.35 90 bottom
PLABEL42  [PLABEL42]  34.29,2.35 90 bottom
PLABEL43  [PLABEL43]  33.21,2.86 0 bottom
PLABEL44  [PLABEL44]  29.21,2.35 90 bottom
PLABEL45  [PLABEL45]  26.67,2.35 90 bottom
PLABEL46  [PLABEL46]  24.13,2.35 90 bottom
PLABEL47  [PLABEL47]  19.05,2.35 90 bottom
PLABEL48  [PLABEL48]  21.59,2.35 90 bottom
PLABEL49  [PLABEL49]  16.51,2.35 90 bottom
PLABEL50  [PLABEL50]  15.37,2.73 0 bottom
PLABEL51  [PLABEL51]  11.11,2.35 90 bottom
PLABEL52  [PLABEL52]  9.14,2.35 90 bottom
PLABEL53  [PLABEL53]  6.35,2.35 90 bottom
PLABEL54  [PLABEL54]  44.45,17.84 90 bottom
PLABEL55  [PLABEL55]  41.91,17.84 90 bottom
PLABEL56  [PLABEL56]  39.37,19.62 90 bottom
PLABEL57  [PLABEL57]  36.83,19.62 90 bottom
PLABEL58  [PLABEL58]  34.29,19.62 90 bottom
PLABEL59  [PLABEL59]  32.7,20.07 0 bottom
PLABEL60  [PLABEL60]  29.91,20.07 0 bottom
PLABEL61  [PLABEL61]  27.11,20.07 0 bottom
PLABEL62  [PLABEL62]  24.57,20.07 0 bottom
PLABEL63  [PLABEL63]  23.05,20.07 0 bottom
PLABEL64  [PLABEL64]  19.05,18.61 90 bottom
PLABEL65  [PLABEL65]  16.51,18.1 90 bottom
PLABEL67  [PLABEL67]  12.89,13.65 0 bottom
PLABEL68  [PLABEL68]  15.49,19.43 0 bottom
Q3  20.89,16.74 180 top
R1  27.44,3.7 0 top
R2  5.71,4 0 top
R3  16.64,19.01 0 top
R4  5.71,5.02 180 top
R5  25.77,18.24 90 top
R6  16.64,10.41 0 top
R7  5.19,18.07 180 top
R8  7.65,9.02 90 top
R9  7.75,13.65 90 top
R10  7.75,11.75 270 top
R11  19.88,4 180 top
R12  5.71,5.97 180 top
R13  5.14,16.85 180 top
R14  28.88,4.14 90 top
R15  40.96,18.54 270 top
R16  37.35,8.06 0 top
R17  39.45,8.06 180 top
R21  13.14,7.43 180 top
SJ1  11.24,11.81 180 bottom
SW1  9.46,5.08 180 top
SW2  15.88,5.08 180 top
SWC  16.89,9.33 270 bottom
SWD  19.43,9.33 270 bottom
TP3  12.45,4.45 0 bottom
U1  29.59,17.4 0 top
U2  16.89,16.45 180 top
U3  10.12,9.46 90 top
U4  36.51,17.02 270 top
U$31  2.54,20.32 270 top
U$32  2.54,2.54 270 top
U$34  10.79,20.45 270 top
U$35  49.7,17.53 270 top
U$73  [ADAFRUIT_3.5MM]  27.11,14.22 270 top
U$74  [PCBFEAT-REV-040]  31.62,13.84 0 top
U$75  [FEATHERLOGO_MED]  22.42,5.27 0 bottom
U$76  [ADAFRUIT_TEXT_20MM]  50.74,5.27 0 bottom
X1  10.92,17.91 0 top
X2  23.18,10.16 270 top
X6  3.87,11.43 270 top
Y1  14.41,10.73 90 top

### Tracks (layer width: path | path; a pad name or v marks a point on that pad's centre or on a via)
1.2V  (via drill 0.3, 0.35)
  Top 0.178: C18.2 16.51,9.84 17.55,9.84 17.93,10.22 18.63,10.22 18.7,10.16 X2.23 20.41,10.16 20.64,9.92 v20.64,9.53 | C6.2 23.58,5.35 X2.39 23.58,7.24 23.83,7.49 | v32.32,6.68 32.26,6.68 31.99,6.95 L1.P$1 31.99,8.89 31.59,9.29 31.59,10.2 31.2,10.58 29.7,10.58 29.11,9.98 C7.2 29.07,9.73 28.75,9.41 28.4,9.41 27.95,8.96 X2.50 26.09,8.96 25.68,9.38 v25.68,10.08 | X2.6 23.98,12.7 v23.94,12.66
  Top 0.203: v23.83,7.64 23.83,7.49
  Top 0.305: L1.P$1 31.99,6.7 C8.1
  Bottom 0.178: v32.32,6.68 31.82,6.68 31.38,7.11 24.36,7.11 v23.83,7.64 23.22,8.26 21.34,8.26 20.89,8.7 20.89,9.28 v20.64,9.53 | v25.68,10.08 25.38,10.08 23.94,11.52 v23.94,12.66
3.3V  (via drill 0.35, 0.38, 0.39)
  Top 0.178: U2.5 17.78,15.21 | 21.27,8.26 21.32,8.21 21.23,8.21 | 25.08,8.24 25.08,8.26 | 25.15,12.13 25.15,12.06 25.08,12.06 | 22.14,12.82 21.98,12.99 X2.11 | C14.1 17.57,11.42 19.08,11.42 19.14,11.36 X2.20 20.45,11.36 | C15.1 16.79,13.53 | 23.18,8.26 X2.38 23.18,5.93 22.54,5.3 C16.1 | 20.44,7.42 20.38,7.36 X2.30 19.62,7.36 18.92,6.67 C22.1 | 25.91,12.9 25.91,13.03 25.98,13.09 X2.1 26.6,14.28 26.6,14.76 25.21,16.14 25.21,16.89 24.57,17.53 C12.1 C10.1 24.77,19.12 24.91,19.12 25.29,18.75 R5.2 26.2,19.18 30.86,19.18 U1.8 | X2.54 X2.53 | X2.54 27.15,10.56 | C13.1 28.52,8.56 X2.49 26.1,8.56 25.78,8.24 | X2.54 26.07,10.56 25.75,10.88 | R17.1 39.45,8.57 39.45,10.34 v38.89,10.9 | v36.83,10.79 36.83,9.48 CONN1.2 36.77,8.13 R16.1 C9.1 | v44.07,13.34 44.83,14.1 44.83,15.88 44.02,16.69 43.38,16.69 43.24,16.55 CN2.1 41.45,16.55 41.39,16.62 41.39,17.54 40.96,17.97 | v31.41,12.01 31.41,11.79 33.44,9.77 33.44,5.78 33.1,5.44 32.65,5.44 31.93,4.71 31.93,4.05 31.49,4.05 LED1.2 30.82,3.38 29.14,3.38 R14.1 28.88,3.68 27.96,3.68 R1.2 | U4.8 40.01,18.92 40.96,17.97 | R15.2 40.96,17.97 | X2.45 25.98,7.41 25.15,8.24
  Top 0.254: 25.08,10.79 25.08,8.26 23.18,8.26 21.27,8.26 21.27,10.1 20.99,10.38 20.99,10.83 20.45,11.36 | 25.08,10.79 25.08,12.06 23.66,12.06 22.91,12.82 22.14,12.82 | 20.44,7.42 21.23,8.21 | 25.91,12.9 25.15,12.13 | 27.15,10.56 28.19,10.56 28.3,10.67 28.77,10.67 29.27,11.18 C17.1 29.97,11.81 31.41,11.81 v31.41,12.01 | 25.08,10.79 25.16,10.88 25.75,10.88 | 25.78,8.24 25.15,8.24 25.08,8.24 | C5.1 35.52,13.05 36.83,11.75 v36.83,10.79
  Top 0.305: 17.78,15.21 17.35,15.21 15.62,13.48 C4.1 16.54,12.47 v16.79,12.47 v16.79,12.46 | C14.1 17.3,11.95 v16.79,12.46 | v16.79,12.46 16.79,13.53 | v15.37,7.94 15.37,7.87 15.21,7.71 13.94,7.71 R21.1
  Top 0.406: JP1.15 JP1.14 11.61,1.45 11.61,2.74 12.51,3.65 C11.1
  Bottom 0.305: 15.2,7.77 v15.37,7.94 14.73,8.57 14.73,10.4 v16.79,12.46 | v44.07,13.34 41.72,13.34 39.29,10.9 v38.89,10.9 v38.9,10.89 38.58,10.57 37.05,10.57 v36.83,10.79 32.42,10.79 31.41,11.8 v31.41,12.01
  Bottom 0.406: JP1.15 8.89,4.7 10.16,5.97 13.4,5.97 15.2,7.77
!RESET
  Top 0.178: 9.65,4 SW1.A 6.35,2.87 JP1.16 | 9.65,4 SW1.A' | 9.65,4 9.65,6.22 11.24,7.81 12,7.81 12.38,7.43 R21.2 12.64,6.79 15.46,6.79 16.92,8.26 18,8.26 18.7,8.96 X2.26
A0
  Top 0.178: JP1.12 17.4,1.27 18.5,2.38 20.63,2.38 20.98,2.73 22.96,2.73 23.98,3.75 X2.40
A1
  Top 0.178: JP1.11 20.03,1.27 21.13,2.38 23.1,2.38 24.38,3.65 X2.41
A2
  Top 0.178: JP1.10 22.54,1.27 24.78,3.5 X2.42
A3
  Top 0.178: JP1.9 24.38,1.52 24.49,1.63 25.18,2.32 X2.43
ADC_AVDD
  Top 0.178: R1.1 26.94,4.65 C19.1 26.82,4.66 26.73,4.75 26.73,4.95 26.35,5.33 26.35,5.71 26.07,5.99 25.77,5.99 25.58,6.18 X2.44
CC1
  Top 0.178: X6.A5 3.83,12.68 3.27,13.24 3.27,15.46 4.64,16.83 R13.2
CC2
  Top 0.178: R12.2 4.89,5.97 3.2,7.66 3.2,9.3 3.6,9.69 5.55,9.69 5.56,9.68 X6.B5
D4  (via drill 0.3)
  Top 0.178: X2.7 23.58,15.15 23.8,15.37 v23.75,15.43
  Bottom 0.178: JP3.5 25.46,20.45 22.67,20.45 19.39,17.17 18.94,17.17 18.67,16.9 18.67,16.26 19.88,15.05 20.76,15.05 21.08,15.37 21.08,15.88 21.4,16.19 21.9,16.19 22.38,15.71 23.46,15.71 v23.75,15.43
D5  (via drill 0.3)
  Top 0.178: v23.36,16.26 23.36,15.82 23.2,15.66 23.2,14.26 23.18,14.23 X2.8
  Bottom 0.178: v23.36,16.26 23.36,16.32 22.96,16.72 22.96,17.25 24.38,18.67 27.35,18.67 28.16,19.48 30.11,19.48 30.46,19.84 34.54,19.84 35.25,20.55 37.29,20.55 37.94,21.2 37.94,21.21 38.38,21.65 JP3.10
D6  (via drill 0.3)
  Top 0.178: X2.9 22.81,13.59 22.81,14.37 22.85,14.41 22.85,16 22.82,16.03 22.82,16.04 v22.61,16.26
  Bottom 0.178: v22.61,16.26 22.61,17.41 24.22,19.02 27.2,19.02 28.01,19.84 29.96,19.84 30.32,20.19 34.39,20.19 35.41,21.21 36.39,21.21 JP3.9
D7  (via drill 0.3, 0.35)
  Top 0.178: v21.7,15.56 22.14,15.56 22.49,15.22 22.49,14.62 22.38,14.5 X2.10 | R7.1 8.47,18.07 8.88,18.48 13.14,18.48 14.35,17.27 v14.41,17.27
  Bottom 0.178: JP3.4 23.37,21.65 19.24,17.53 18.8,17.53 18.32,17.05 | 18.32,17.05 18.31,17.04 18.31,16.11 19.73,14.69 20.96,14.69 21.45,15.18 21.45,15.44 21.57,15.56 v21.7,15.56 | v14.41,17.27 18.1,17.27 18.32,17.05
D9  (via drill 0.3)
  Top 0.178: X2.13 21.18,14.83 20.51,15.49 v20.51,15.62
  Bottom 0.178: v20.51,15.62 20.44,15.69 20.44,16.64 23.18,19.38 27.05,19.38 27.87,20.19 29.82,20.19 30.17,20.55 32.21,20.55 33.31,21.65 JP3.8
D10  (via drill 0.3)
  Top 0.178: X2.14 20.78,14.15 19.81,15.11 v19.81,16.07 | JP3.7 31.75,20.77 32.13,20.38 36.13,20.38 36.82,19.7 36.82,17.79 36.83,17.78 36.83,15.3 37.66,14.48 40.51,14.48 40.59,14.55 CN2.5
  Bottom 0.178: v19.81,16.07 20.03,16.29 20.07,16.26 20.07,16.76 23.04,19.74 26.91,19.74 27.72,20.55 29.67,20.55 30.77,21.65 JP3.7
D11  (via drill 0.3)
  Top 0.178: X2.15 20.38,13.85 19.18,15.05 19.18,16.51 v19.24,16.57 | JP3.6 30.19,21.65 31.81,20.03 35.98,20.03 36.46,19.55 36.46,15.13 37.47,14.12 41.96,14.12 CN2.6
  Bottom 0.178: JP3.6 28.32,21.65 26.76,20.09 22.82,20.09 19.3,16.57 v19.24,16.57
D24  (via drill 0.3)
  Top 0.178: v25.76,5.34 25.59,5.17 25.59,2.35 JP1.8 | X2.36 22.38,6.25 21.98,5.86 21.76,5.86 v21.75,5.87
  Bottom 0.178: v25.76,5.34 25.39,4.97 22.71,4.97 21.81,5.87 v21.75,5.87
D25  (via drill 0.3)
  Top 0.178: X2.37 22.78,6.04 21.84,5.11 v21.78,5.11 | JP1.7 28.26,1.27 27.11,2.41 26.42,2.41 26.14,2.69 v26.14,4.71
  Bottom 0.178: v26.14,4.71 26.02,4.6 22.29,4.6 v21.78,5.11
D+  (via drill 0.3)
  Top 0.178: v7.72,10.48 7.72,11.21 R10.2 | X2.52 27.38,9.76 v27.57,9.95
  Bottom 0.178: v7.72,10.48 7.72,12.38 9.05,13.72 17.75,13.72 18.52,12.95 22.99,12.95 23.29,13.26 24.3,13.26 24.7,12.87 24.7,12.31 27.06,9.95 v27.57,9.95
D-  (via drill 0.3)
  Top 0.178: v8.51,13.97 8.32,14.16 R9.2 | v28.31,9.95 28.31,9.89 27.78,9.36 X2.51
  Bottom 0.178: v8.51,13.97 8.61,14.07 17.9,14.07 18.66,13.31 22.84,13.31 23.14,13.61 24.45,13.61 25.05,13.02 25.05,12.46 27.02,10.49 27.79,10.49 28.31,9.97 v28.31,9.95
EN
  Top 0.178: U2.3 16.13,17.93 R3.1 16.13,19.37 18.41,21.65 JP3.2
GND  (via drill 0.4)
  Top 0.203: X2.47 27.48,7.76 28.07,7.18
  Top 0.305: X1.NC1 6.44,20.13 v5,20.13 5.02,20.13 | C3.1 12.55,9.46 U3.2 | U1.4 29.52,16.2 v29.59,16.13 U1.PAD | C15.2 17.91,13.14 17.65,12.89 v17.65,12.61 | R12.1 7.3,5.97 SW1.B | v10.03,8.19 10.03,8.06 9.78,7.81 6.57,7.81 X6.B1A12 | C20.2 9.78,12.57 9.78,14.96 9.92,15.1 X1.1 | X2.P$1 22.99,10.16 22.61,9.78 v22.61,9.65 | C6.1 22.99,3.75 C16.2 | DEBUG.MT2 34.75,6.56 C9.2 | v32.23,10.01 32.01,10.23 32.01,10.37 31.2,11.18 C17.2 | U4.4 33.91,14.06 C5.2 33.65,13.44 34.47,12.61 CONN1.MT2 | C14.2 15.68,12.3 15.59,12.3 | 28.07,7.18 28.57,7.18 28.64,7.11 C13.2 28.83,6.92 29.4,6.35 C8.2 | C19.2 27.96,5.5 27.94,5.52 C21.2
  other vias: 11.62,21.91 8.57,6.48 10.35,4.76 14.41,5.27 14.35,15.94 16.89,16.57 29.65,18.12 18.73,20.19 14.73,14.67 7.49,5.27 2.22,11.62 1.33,8.32 1.14,14.22 7.24,16.89 7.24,15.49 14.03,8.51 18.1,5.27 12.79,2.68 30.91,9.96 28.45,5.46 29.71,5.35 38.4,6.63 40.06,10.41 43.46,12.57 44.68,10.26 44.98,9.17 45.62,5.92 40.77,3.43 40.12,13.44 43.26,14.27 46.95,16.73 15.43,8.89 18.67,14.29 13.02,17.53 12.51,19.24 9.4,21.78 9.21,19.49 21.02,20.19 7.37,7.56 32.84,6.03 35.61,4.34 28.77,13.72 35.8,11.53 34.85,9.94 35.61,15.47 37.45,17.12 40.75,17.12 37.01,12.67 37.45,19.15
  pour Top: 0,22.86 50.8,22.86 50.8,0 0,0
  pour Bottom: 0,22.86 50.74,22.86 50.74,0 0,0
HSTX12  (via drill 0.3, 0.35)
  Top 0.178: X2.16 20.38,12.96 20.5,12.83 21.52,12.83 21.99,12.36 22.65,12.36 v22.65,12.24 | v43.74,11.7 43.59,11.55 CN2.11
  Bottom 0.178: v22.65,12.24 22.72,12.24 25.63,9.32 39.85,9.32 41.96,11.43 43.47,11.43 v43.74,11.7
HSTX13  (via drill 0.3, 0.35)
  Top 0.178: v21.22,12.23 21.02,12.42 20.4,12.42 20.25,12.56 X2.17 | v44.2,11.05 41.97,11.05 CN2.12
  Bottom 0.178: v21.22,12.23 21.79,12.23 22.38,11.63 22.8,11.63 25.46,8.97 40.03,8.97 42.11,11.05 v44.2,11.05
HSTX14  (via drill 0.35)
  Top 0.178: X2.18 19.12,12.16 v18.9,12.38 | v43.31,10.09 43.27,10.05 CN2.14
  Bottom 0.178: v18.9,12.38 20.23,12.38 20.93,11.68 21.8,11.68 22.2,11.28 22.63,11.28 25.29,8.61 41.19,8.61 42.46,9.88 43.09,9.88 v43.31,10.09
HSTX15  (via drill 0.35)
  Top 0.178: X2.19 19.25,11.76 19.23,11.78 18.39,11.78 v18.18,11.99 | v44.01,9.53 41.99,9.53 CN2.15
  Bottom 0.178: v18.18,11.99 18.37,11.8 20.27,11.8 20.8,11.28 21.7,11.28 22.06,10.92 22.48,10.92 25.15,8.26 41.34,8.26 42.61,9.53 v44.01,9.53
HSTX16  (via drill 0.35)
  Top 0.178: X2.27 18.85,8.56 18.17,7.88 17.09,7.88 15.82,6.61 15.82,5.66 v15.89,5.66 | v44.84,8.28 44.64,8.48 42.03,8.48 CN2.17
  Bottom 0.178: v15.89,5.66 16.2,5.34 16.2,4.3 18.12,2.39 38.61,2.39 40.54,4.32 43.5,4.32 44.9,5.71 44.9,8.23 v44.84,8.28
HSTX17  (via drill 0.35)
  Top 0.178: X2.28 19.02,8.16 18.38,7.53 17.4,7.53 16.4,6.53 v16.4,6.34 | v44.33,7.64 43.91,8.05 CN2.18
  Bottom 0.178: v16.4,6.34 16.4,6.02 16.62,5.8 16.62,4.45 18.33,2.74 38.38,2.74 40.31,4.67 43.22,4.67 44.45,5.9 44.45,7.51 v44.33,7.64
HSTX18  (via drill 0.35)
  Top 0.178: X2.29 19.14,7.76 18.51,7.12 17.55,7.12 17,6.57 17,5.5 v17.19,5.3 | v43.76,6.79 43.5,7.05 CN2.20
  Bottom 0.178: v17.19,5.3 17.3,5.3 17.3,4.28 18.48,3.1 38.24,3.1 40.17,5.03 43.01,5.03 44.01,6.03 44.01,6.54 v43.76,6.79
HSTX19  (via drill 0.35)
  Top 0.178: X2.31 19.85,6.14 v19.7,6.29 | v43.3,6.15 42.89,6.55 CN2.21
  Bottom 0.178: v19.7,6.29 19.58,6.16 19.58,4.73 20.85,3.45 38.06,3.45 39.99,5.38 42.8,5.38 43.3,5.88 v43.3,6.15
LX
  Top 0.203: X2.48 27.72,8.16 28.19,7.68
  Top 0.305: L1.P$2 29.73,8.19 29.23,7.68 28.19,7.68
MISO  (via drill 0.35)
  Top 0.178: v20.14,5.62 20.22,5.62 20.78,6.18 X2.32 | v33.66,4.02 33.66,3.81 36.2,1.27 JP1.4
  Bottom 0.178: v20.14,5.62 20.14,5.19 20.27,5.06 20.27,4.54 21,3.81 33.44,3.81 v33.66,4.02
MOSI  (via drill 0.3, 0.35)
  Top 0.178: v22.61,7.62 22.41,7.43 22.17,7.43 21.98,7.24 X2.35 | v33.22,4.86 33.22,4.43 33.06,4.27 33.06,2.5 JP1.5
  Bottom 0.178: v22.61,7.62 23,7.62 23.87,6.76 31.14,6.76 33.03,4.86 v33.22,4.86
N$1
  Top 0.178: CHG.C 3.11,5.4 4.51,4 R2.1
N$2
  Top 0.178: L.A 3.41,17.42 4.06,18.07 R7.2
N$3
  Top 0.178: R2.2 6.86,4.64 8.06,4.64 9.26,5.83 9.26,6.54 11.23,8.51 U3.1
N$4
  Top 0.178: U3.5 R8.1
N$5
  Top 0.178: C2.2 13.43,11.2 Y1.3 14.51,10.84 15.54,10.84 15.71,11.01 18.96,11.01 19.02,10.96 X2.21
N$6
  Top 0.178: R6.1 15.28,10.41 15.1,10.24 15.1,10.03 15.04,10.1 Y1.1 15.04,9.8 14.4,9.17 13.46,9.17 12.65,8.36 C3.2
N$7
  Top 0.178: X2.22 18.89,10.56 18.83,10.61 17.34,10.61 R6.2
N$8  (via drill 0.38)
  Top 0.305: U3.3 10.35,10.41 v10.29,10.35
  Bottom 0.305: SJ1.1 10.26,11.59 10.26,10.38 v10.29,10.35
NEOPIX  (via drill 0.35)
  Top 0.178: X2.33 21.18,6.03 20.86,5.72 v20.86,5.15 | v29.66,4.39 29.66,4.11 29.8,3.97 LED1.1
  Bottom 0.178: v20.86,5.15 20.88,5.13 20.88,4.49 21.21,4.17 29.66,4.17 v29.66,4.39
PSRAM_CS  (via drill 0.3, 0.35)
  Top 0.178: X2.12 21.58,14.51 v21.92,14.85 | v35.75,18.48 35.56,18.67 34.17,18.67 U4.1 | R15.1 v41.78,19.05 41.78,17.4 42.04,17.14 44.07,17.14 46.23,14.99 v46.67,14.99
  Bottom 0.178: v21.92,14.85 23.99,14.85 25.84,16.7 25.84,17.11 26.23,17.51 31.16,17.51 32,18.35 35.62,18.35 v35.75,18.48 36.89,18.48 36.97,18.56 41.29,18.56 v41.78,19.05 | JP1.1 44.45,2.79 46.74,5.08 46.74,14.92 v46.67,14.99
QSPI_CS  (via drill 0.3)
  Top 0.178: U1.1 26.64,18.6 R5.1 25.7,17.66 25.7,16.17 27.36,14.51 27.36,13.55 26.76,12.96 X2.60 27.04,13.32 v27.04,13.72 | R11.1 19.75,3.37 13.31,3.37 13.13,3.54 13.13,5.76 v11.67,7.22
  Bottom 0.178: v27.04,13.72 26.76,14 25.81,14 25.48,14.33 25.11,14.33 24.95,14.49 22.33,14.49 22.14,14.31 19.61,14.31 18.62,15.3 8.06,15.3 5.79,13.03 5.79,10.66 7.11,9.34 7.94,9.34 8.57,9.97 9.14,9.97 11.68,7.43 11.68,7.23 v11.67,7.22
QSPI_DATA[0]  (via drill 0.35)
  Top 0.178: X2.57 27.56,11.76 27.66,11.86 28.25,11.86 29.44,13.06 30.59,13.06 31.2,13.66 31.2,15.04 31.04,15.19 v31.04,15.38 31.04,15.39 31.31,15.66 31.31,16.07 U1.5 | U4.5 38.88,15.35 37.61,15.35 v37.49,15.47
  Bottom 0.178: v31.04,15.38 31.2,15.23 31.2,14.74 31.59,14.35 36.36,14.35 v37.49,15.47
QSPI_DATA[1]  (via drill 0.35)
  Top 0.178: U1.2 27.36,17.8 26.48,16.92 26.53,16.88 | X2.59 27.2,12.56 27.71,13.07 27.71,14.66 26.39,15.98 26.39,16.74 26.53,16.88 | v26.41,16.87 26.85,16.87 26.69,17.04 26.53,16.88 | v35.48,17.12 34.95,17.65 U4.2
  Bottom 0.178: v35.48,17.12 v35.47,17.13 26.66,17.13 v26.41,16.87
QSPI_DATA[2]  (via drill 0.35)
  Top 0.178: U1.3 27.58,17 27.11,16.54 27.11,16.41 | 27.11,16.41 27.11,16.35 27.11,15.76 28.07,14.8 28.07,12.91 27.3,12.14 26.6,12.14 X2.58 | 27.11,16.41 v26.96,16.26 | v35.5,16.32 35.43,16.38 U4.3
  Bottom 0.178: v26.96,16.26 27,16.26 27.51,16.76 34.92,16.76 35.37,16.32 v35.5,16.32
QSPI_DATA[3]  (via drill 0.38)
  Top 0.178: U1.7 32.05,17.8 32.25,17.6 | 32.25,17.6 32.36,17.48 32.36,13.82 30.86,12.32 29.72,12.32 28.55,11.15 27.96,11.15 27.77,10.96 X2.55 | 32.25,17.6 v32.25,17.74 | v37.4,17.97 37.72,17.97 38.04,17.65 U4.7
  Bottom 0.178: v32.25,17.74 32.4,17.59 34.86,17.59 34.99,17.72 37.15,17.72 v37.4,17.97
QSPI_SCK  (via drill 0.35, 0.38)
  Top 0.178: U1.6 31.82,17 32.01,16.81 32.01,15.72 31.83,15.54 31.83,15.04 v31.78,14.99 31.82,14.95 31.82,13.78 30.74,12.7 29.59,12.7 28.4,11.51 27.81,11.51 27.66,11.36 X2.56 | U4.6 37.78,16.38 37.66,16.26 v37.53,16.26
  Bottom 0.178: v31.78,14.99 32.03,14.73 36.2,14.73 36.83,15.37 36.83,15.75 37.34,16.26 v37.53,16.26
RX  (via drill 0.3, 0.35)
  Top 0.178: X2.3 25.18,14.78 25.27,14.88 v25.34,14.88 | v33.19,12.45 32.68,11.94 32.68,11.07 33.8,9.96 33.8,4.75 36.13,2.41 38.23,2.41 JP1.3
  Bottom 0.178: v25.34,14.88 25.59,15.13 26.29,15.13 26.64,14.78 29.77,14.78 31.15,13.4 31.91,13.4 32.87,12.45 v33.19,12.45
SCK  (via drill 0.3, 0.35)
  Top 0.178: X2.34 v21.57,7.64 | v32.52,4.5 32.65,4.37 32.65,2.17 JP1.6
  Bottom 0.178: v21.57,7.64 21.75,7.64 22.41,6.98 23.09,6.98 23.67,6.4 30.99,6.4 32.52,4.87 v32.52,4.5
SCL  (via drill 0.3, 0.35)
  Top 0.178: X2.5 24.38,15.81 24.18,16 v24.18,16.05 | v38.8,12.32 38.06,11.58 38.06,10.68 38.77,9.97 CONN1.4 38.94,9.26 R17.2 | CN2.3 43.12,15.55 v43.43,15.24 | JP3.11 43.24,20.32 44.7,20.32 v44.83,20.19
  Bottom 0.178: v24.18,16.05 24.18,16.24 23.48,16.94 23.48,17.27 24.53,18.31 27.5,18.31 28.31,19.13 30.32,19.13 30.68,19.48 34.69,19.48 35.4,20.19 37.52,20.19 37.88,20.55 39.83,20.55 40.93,21.65 JP3.11 | v38.8,12.32 38.8,13.14 40.9,15.24 v43.43,15.24 43.69,15.24 44.32,15.88 44.32,17.27 44.83,17.78 v44.83,20.19
SDA  (via drill 0.3, 0.35)
  Top 0.178: v24.11,17.11 24.11,16.92 24.75,16.29 24.75,14.32 24.78,14.3 X2.4 | v43.69,16.07 43.67,16.05 CN2.2 | v37.91,12.32 37.65,12.06 37.65,9.55 CONN1.3 37.86,9.34 R16.2
  Bottom 0.178: v24.11,17.11 24.18,17.18 24.18,17.37 24.77,17.96 27.64,17.96 28.46,18.77 30.52,18.77 30.87,19.13 34.83,19.13 35.45,19.75 37.64,19.75 38.09,20.19 43.03,20.19 44.45,21.61 JP3.12 43.88,21.08 43.88,16.26 v43.69,16.07 43.37,16.07 43.05,15.75 40.83,15.75 38.35,13.27 38.35,12.83 37.91,12.38 v37.91,12.32
SWCLK  (via drill 0.35)
  Top 0.178: X2.24 18.02,9.76 17.72,9.46 17.28,9.46 v17.09,9.27 | v36.39,6.03 36.45,5.97 36.45,4.11 DEBUG.1
  Bottom 0.178: v17.09,9.27 17.03,9.34 SWC.P$1 16.89,9.57 17.78,10.46 21.09,10.46 21.63,9.91 21.63,9.18 21.84,8.97 23.81,8.97 24.92,7.86 34.87,7.86 36.39,6.34 v36.39,6.03
SWDIO  (via drill 0.35, 0.38)
  Top 0.178: X2.25 18.25,9.36 v17.78,8.89 | DEBUG.3 38.47,5.29 v38.23,5.52
  Bottom 0.178: v17.78,8.89 18.8,8.89 SWD.P$1 20,10.1 20.94,10.1 21.27,9.77 21.27,8.88 21.55,8.61 23.67,8.61 24.77,7.5 34.09,7.5 36.13,5.46 38.16,5.46 v38.23,5.52
TX  (via drill 0.3, 0.35)
  Top 0.178: v26.04,14.54 25.87,14.38 25.73,14.38 25.57,14.21 25.57,13.57 X2.2 | v33.28,11.65 33.28,11.1 34.18,10.2 34.18,4.88 36.26,2.79 39.43,2.79 40.96,1.27 JP1.2
  Bottom 0.178: v33.28,11.65 33.16,11.65 31.82,12.99 31.06,12.99 29.67,14.38 26.2,14.38 v26.04,14.54
USB_D+  (via drill 0.3)
  Top 0.178: 6.91,11.68 7.49,12.26 R10.1 | X6.A6 6.91,11.68 | 6.91,11.68 7.11,11.48 7.11,10.92 6.87,10.68 X6.B6 5.07,10.68 4.49,11.26 3.67,11.26 v2.65,10.24
  Bottom 0.178: v2.65,10.24 2.63,10.22 D+1.TP
USB_D-  (via drill 0.3)
  Top 0.178: X6.A7 5.2,11.18 5.08,11.3 5.08,11.94 5.32,12.18 X6.B7 | X6.B7 6.18,12.15 6.71,12.15 6.99,12.43 6.99,12.89 7.24,13.14 R9.1 | X6.B7 3.12,12.18 v2.67,12.64
  Bottom 0.178: v2.67,12.64 1.59,12.64 D-1.TP
USBBOOT  (via drill 0.3)
  Top 0.178: v13.74,4.83 13.9,4.67 SW2.A SW2.A' 19.13,4 19.14,4 R11.2
  Bottom 0.178: v13.74,4.83 12.45,4.83 TP3.P$1
VBAT  (via drill 0.38)
  Top 0.305: 11.17,12.32 11.17,12.87 11.92,13.61 X1.2 11.92,15.8 12.76,16.64 14.99,16.64 15.23,16.4 | 11.17,12.32 C20.1 | JP3.1 16.51,20.59 15.45,19.53 15.45,18.84 15.23,18.61 15.23,16.4 | 15.23,16.4 15.49,16.13 16.32,16.13 16.57,15.88 17.16,15.88 18.11,16.82 18.25,16.82 18.64,17.21 19.6,17.21 Q3.3 | v12.32,12.7 11.94,12.32 11.17,12.32
  Bottom 0.305: v12.32,12.7 12.32,12.13 SJ1.2
VBUS  (via drill 0.38, 0.4)
  Top 0.305: X6.A4B9 5.62,13.83 5.38,13.59 3.94,13.59 v3.87,13.53 | X6.B4A9 5.62,9.03 5.38,9.27 4.06,9.27 v3.81,9.02 | 3.11,6.22 1.16,6.22 CHG.A | v3.11,6.35 3.11,6.22 | JP3.3 22.73,20.51 22.73,17.26 21.84,16.37 Q3.1 | v4.94,18.91 v4.95,18.9 5.64,18.9 D4.A | R4.2 4.45,5.02 3.24,6.22 3.11,6.22 | U3.4 v8.82,9.34 v8.83,9.34
  Bottom 0.305: 3.94,6.35 v3.11,6.35 3.56,6.35 3.75,6.54 3.75,12.13 3.87,12.26 v3.87,13.53 3.62,13.78 3.62,17.27 4.64,18.29 | v4.94,18.91 4.83,18.8 4.83,18.48 4.64,18.29 | 4.64,18.29 18.16,18.29 21.53,21.65 JP3.3 | v3.81,9.02 3.81,6.48 3.94,6.35 | 3.94,6.35 4.51,5.78 6.79,5.78 8.83,7.81 v8.83,9.34
VHI  (via drill 0.39)
  Top 0.178: R3.2 17.69,19.01 17.84,18.86 U2.1 | Q3.2 21.84,17.32 21.49,17.67 17.92,17.67 U2.1 | U2.1 18.73,17.75 19.68,18.7 C1.1
  Top 0.305: v5.89,22.15 5.87,22.12 D4.C | v17.88,19.65 17.24,19.01 R3.2
  Bottom 0.305: v5.89,22.15 5.89,20.71 6.22,20.38 14.67,20.38 15.4,19.65 v17.88,19.65
VREG_AVDD
  Top 0.178: X2.46 26.74,7.36 C21.1 27.69,6.54 28.02,6.21 28.8,6.21 29.08,5.93 29.08,4.72 29.01,4.65 R14.2

### Text on the board
Pinguin_tBackup: Bat | EN | USB | 7 | 4 | 11 | 10 | 9 | 6 | 5 | SCL | SDA | #7 | Feather RP2350 | PSRAM | HSTX 22-Pin Port | QT | I2C | Reset | Boot | chg | Debug | Rst | 3.3V | GND | A0 | A1 | A2 | A3 | 24 | 25 | SCK | MO | MI | RX | TX | PCS
Pinguin_bBackup: 3.7/4.2V LiPoly / w/USB Charge / or 3.5-6V DC if / CHG disabled | USB | 7 | 4 | 11 | 10 | 9 | 6 | 5 | EN | BAT | SCL | SDA | Feather RP2350 / Dual M33/RISC-V Cores / 8MB Flash/520KB SRAM / HSTX Output + Opt. PSRAM | CHG | GND | SCK | RST | 3V | 3V | A0 | A1 | A2 | A3 | 24 | 25 | MO | MI | RX | TX | PSR / CS